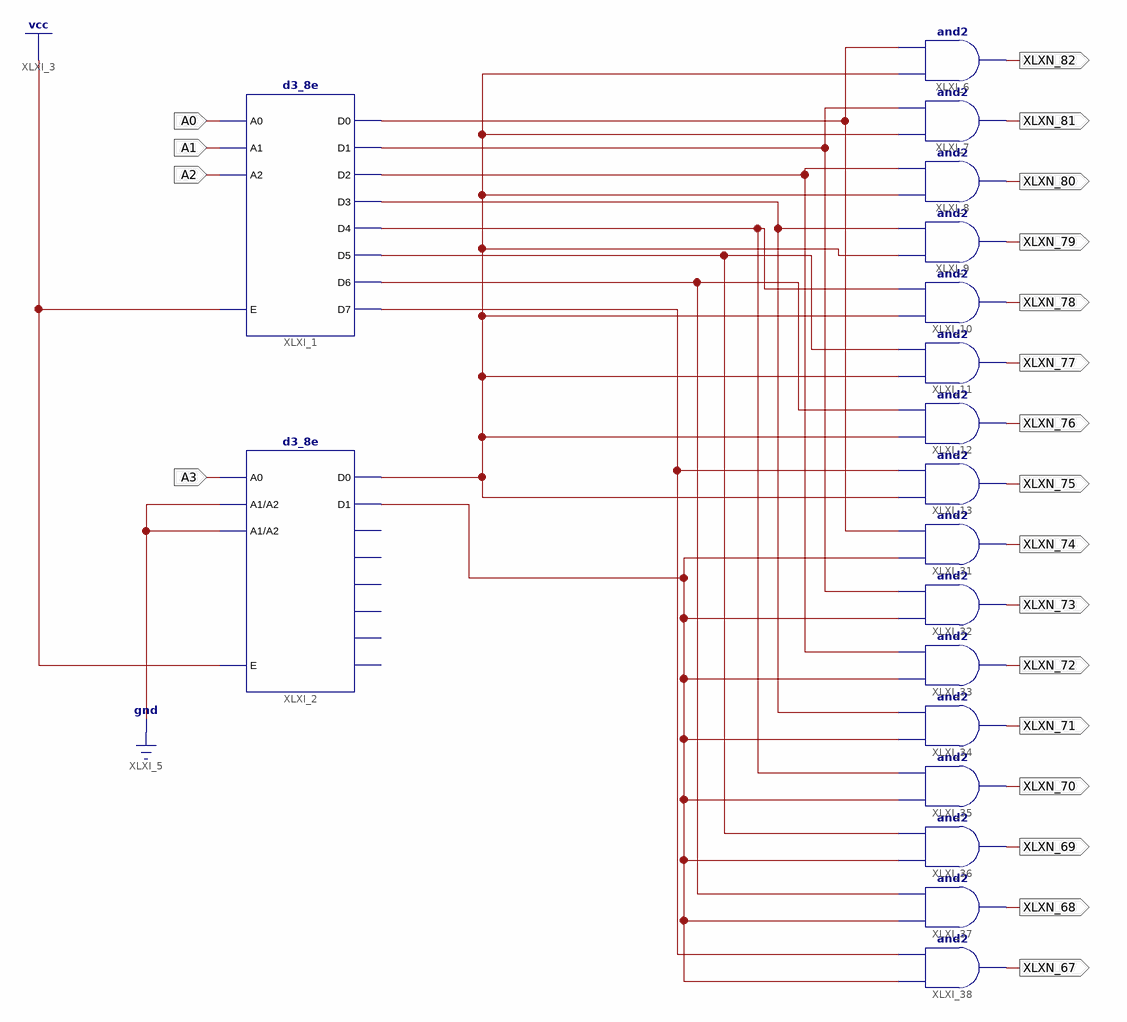
[diagram p0: schematic sheet 1]
// Xilinx ISE schematic C3_28.sch (kintex7) as structural Verilog: 18 symbols, 20 ports
module C3_28 (
  input  A0,
  input  A1,
  input  A2,
  input  A3,
  output XLXN_67,
  output XLXN_68,
  output XLXN_69,
  output XLXN_70,
  output XLXN_71,
  output XLXN_72,
  output XLXN_73,
  output XLXN_74,
  output XLXN_75,
  output XLXN_76,
  output XLXN_77,
  output XLXN_78,
  output XLXN_79,
  output XLXN_80,
  output XLXN_81,
  output XLXN_82
);

  wire XLXN_14, XLXN_36, XLXN_38, XLXN_40, XLXN_48, XLXN_49, XLXN_53, XLXN_56, XLXN_57, XLXN_59;

  d3_8e XLXI_1 (
    .A0(A0), .A1(A1), .A2(A2), .E(1'b1), .D0(XLXN_48), .D1(XLXN_49), .D2(XLXN_56), .D3(XLXN_57),
    .D4(XLXN_40), .D5(XLXN_38), .D6(XLXN_36), .D7(XLXN_14));
  d3_8e XLXI_2 (.A0(A3), .A1(1'b0), .A2(1'b0), .E(1'b1), .D0(XLXN_53), .D1(XLXN_59));  // open: D2, D3, D4, D5, D6, D7
  and XLXI_38 (XLXN_67, XLXN_59, XLXN_14);
  and XLXI_37 (XLXN_68, XLXN_59, XLXN_36);
  and XLXI_36 (XLXN_69, XLXN_59, XLXN_38);
  and XLXI_35 (XLXN_70, XLXN_59, XLXN_40);
  and XLXI_34 (XLXN_71, XLXN_59, XLXN_57);
  and XLXI_33 (XLXN_72, XLXN_59, XLXN_56);
  and XLXI_32 (XLXN_73, XLXN_59, XLXN_49);
  and XLXI_31 (XLXN_74, XLXN_59, XLXN_48);
  and XLXI_13 (XLXN_75, XLXN_53, XLXN_14);
  and XLXI_12 (XLXN_76, XLXN_53, XLXN_36);
  and XLXI_11 (XLXN_77, XLXN_53, XLXN_38);
  and XLXI_10 (XLXN_78, XLXN_53, XLXN_40);
  and XLXI_9 (XLXN_79, XLXN_53, XLXN_57);
  and XLXI_8 (XLXN_80, XLXN_53, XLXN_56);
  and XLXI_7 (XLXN_81, XLXN_53, XLXN_49);
  and XLXI_6 (XLXN_82, XLXN_53, XLXN_48);
endmodule
